# EAGLE design Circuito maquina garra peluches (EAGLE 9.6.2)
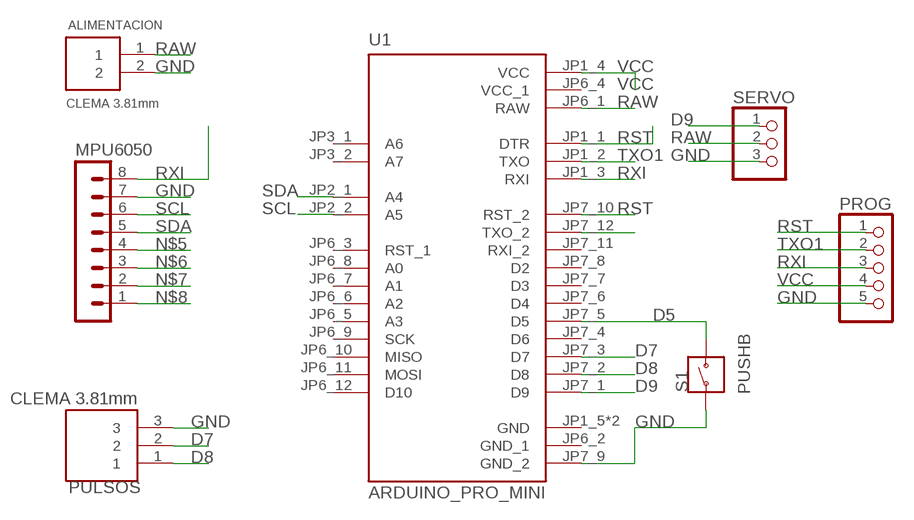
[diagram p0: schematic, sheet 1]

## Parts
ALIMENTACION  CLEMA 3.81mm  1776113-2  [TE_1776113-2]
MPU6050  MA08-1  [MA08-1]
PROG  PINHD-1X5  [1X05]
PULSOS  CLEMA 3.81mm  284392-3  [TE_284392-3]
S1  PUSHB  4-1437565-0  [SW_4-1437565-0]
SERVO  PINHD-1X3/90  [1X03/90]
U1  ARDUINO_PRO_MINI  [MODULE_ARDUINO_PRO_MINI]

## Nets
D5: S1.2 U1.JP7_5(D5)
D7: PULSOS.2 U1.JP7_3(D7)
D8: PULSOS.1 U1.JP7_2(D8)
D9: SERVO.1 U1.JP7_1(D9)
GND: ALIMENTACION.2 MPU6050.7 PROG.5 PULSOS.3 S1.1 SERVO.3 U1.JP7_9(GND_2)
N$5: MPU6050.4
N$6: MPU6050.3
N$7: MPU6050.2
N$8: MPU6050.1
N$11: U1.JP7_12(TXO_2)
RAW: ALIMENTACION.1 SERVO.2 U1.JP6_1(RAW)
RST: PROG.1 U1.JP1_1(DTR) U1.JP7_10(RST_2)
RXI: MPU6050.8 PROG.3 U1.JP1_3(RXI)
SCL: MPU6050.6 U1.JP2_2(A5)
SDA: MPU6050.5 U1.JP2_1(A4)
TXO1: PROG.2 U1.JP1_2(TXO)
VCC: PROG.4 U1.JP1_4(VCC)
Unconnected: U1.JP3_1(A6) U1.JP3_2(A7) U1.JP6_3(RST_1) U1.JP6_5(A3) U1.JP6_6(A2) U1.JP6_7(A1) U1.JP6_8(A0) U1.JP6_9(SCK) U1.JP6_10(MISO) U1.JP6_11(MOSI) U1.JP6_12(D10) U1.JP7_4(D6) U1.JP7_6(D4) U1.JP7_7(D3) U1.JP7_8(D2) U1.JP7_11(RXI_2)

## Power pins joined to a net without a drawn wire
GND: U1.JP1_5(GND) U1.JP1_6(GND)
GND_1: U1.JP6_2(GND_1)
VCC_1: U1.JP6_4(VCC_1)

## Library data of the parts
ALIMENTACION = terminal-block-clema-3.81-1776113-2:1776113-2: Conn Eurostyle Block 2 POS 3.81mm Solder ST Thru-Hole 12A/Contact Check prices <https://pricing.snapeda.com/parts/1776113-2/TE%20Connectivity/view-part?ref=eda>; AVAILABILITY: In Stock; CENTERLINE_PITCH: 3.81 mm[.1499 in]; COMMENT: 1776113-2; DESCRIPTION: 2P,3.81MM,SIDE ENTRY,HIGH TMP; EU_ROHS_COMPLIANCE: Compliant; MF: TE Connectivity; MP: 1776113-2; NUMBER_OF_POSITIONS: 2; PACKAGE: None; PRICE: None; PURCHASE-URL: https://pricing.snapeda.com/search/part/1776113-2/?ref=eda
MPU6050 = con-lstb:MA08-1: PIN HEADER; OC_FARNELL: unknown; OC_NEWARK: unknown
PROG = pinhead:PINHD-1X5: PIN HEADER
PULSOS = terminal-block-clema-3.81-284392-3:284392-3: Check prices <https://pricing.snapeda.com/parts/284392-3/TE%20Connectivity/view-part?ref=eda>; AVAILABILITY: In Stock; COMMENT: 284392-3; DESCRIPTION: Conn Terminal Block 3 POS 3.81mm Solder ST Thru-Hole 12A/Contact; EU_ROHS_COMPLIANCE: Compliant with Exemptions; MF: TE Connectivity; MP: 284392-3; PACKAGE: None; PRICE: None; PURCHASE-URL: https://pricing.snapeda.com/search/part/284392-3/?ref=eda
S1 = pushbutton:4-1437565-0: Switch Tactile OFF (ON) SPST Round Button PC Pins 0.05A 12VDC 1.57N Thru-Hole T/R Check prices <https://pricing.snapeda.com/parts/FSM4JRT/TE%20Connectivity/view-part?ref=eda>; AVAILABILITY: In Stock; COMMENT: 4-1437565-0; DESCRIPTION: features, series, Tactile / Jog, circuitry, voltage, illumination, operation, tactile, style, Pushbutton, Industrial ...; MF: TE Connectivity; MP: FSM4JRT; PACKAGE: None; PRICE: None; PURCHASE-URL: https://pricing.snapeda.com/search/part/FSM4JRT/?ref=eda
SERVO = pinhead:PINHD-1X3: PIN HEADER
U1 = ARDUINO_PRO_MINI:ARDUINO_PRO_MINI: ATmega328 Arduino Pro Mini 328 5V/16MHz AVR® ATmega AVR MCU 8-Bit Embedded Evaluation Board Check prices <https://pricing.snapeda.com/parts/Arduino%20Pro%20Mini/Arduino/view-part?ref=eda>; AVAILABILITY: Not in stock; DESCRIPTION: This board was developed for applications and installations where space is premium and projects are made as permanent set ups. Small, available in 3.3 V and 5 V versions, powered by ATmega328P.; MF: Arduino; MP: Arduino Pro Mini; PACKAGE: None; PRICE: None

## Board
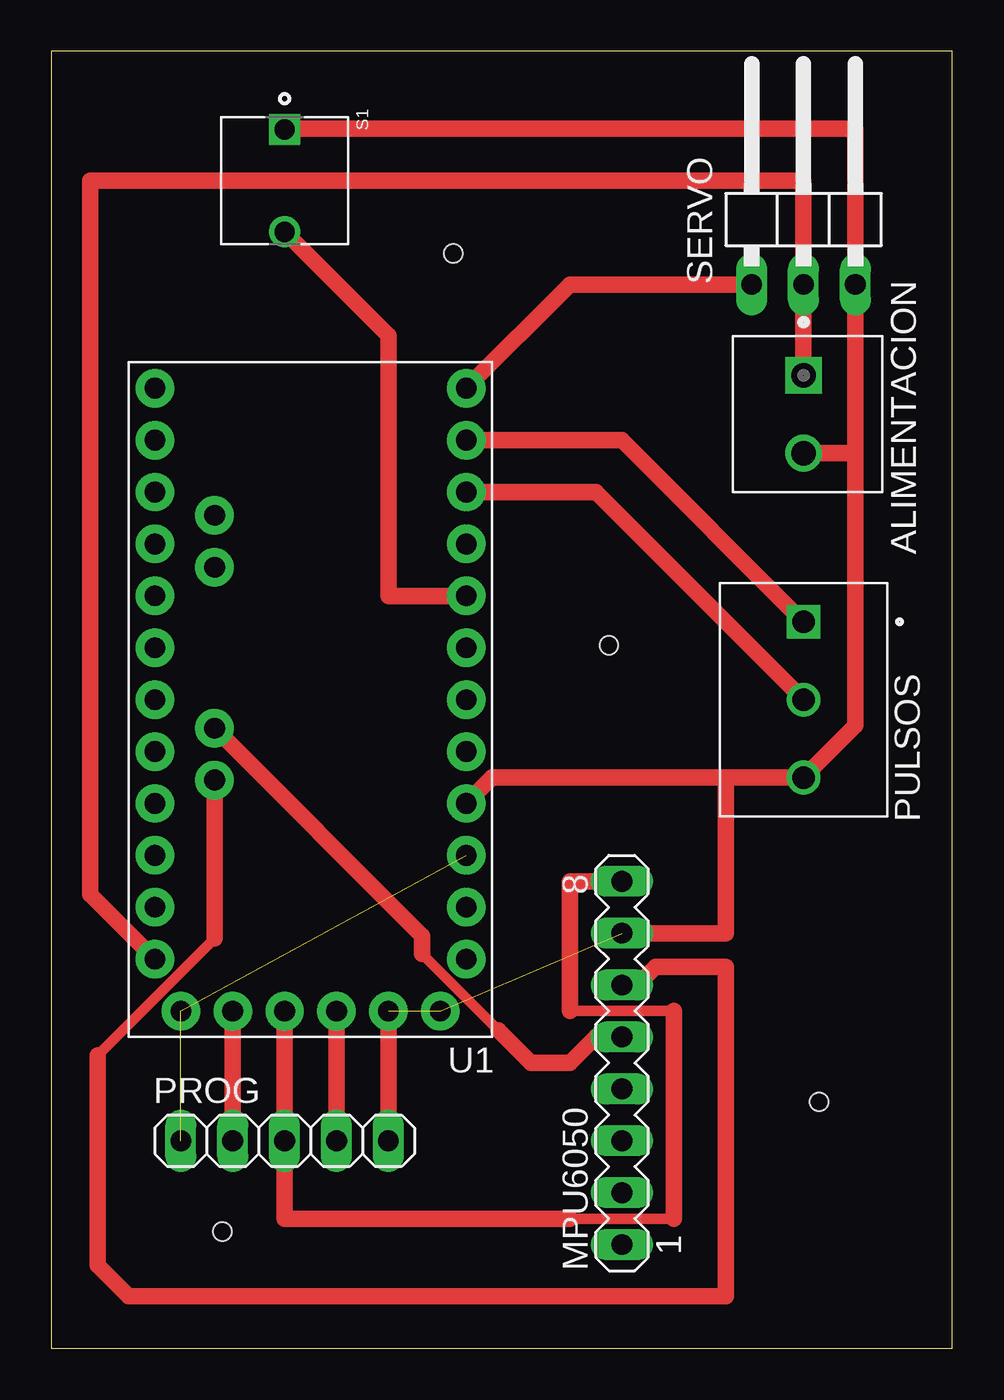
[diagram p1: board, top side]

Size 44.12 x 63.49 mm. Coordinates in mm from the lower left corner, seen from the top.
Outline: 0,0 44.12,0 44.12,63.49 0,63.49 0,0
Copper layers (1*16): Top 0.035mm / dielectric 1.5mm / Bottom 0.035mm
Design rules "default *": minimum track width 6mil, minimum drill 0.35mm, track to track 6mil, track to pad 6mil, pad to pad 6mil, via to via 6mil, smd to smd 6mil, copper to edge 40mil, drill to drill 6mil, minimum pad ring 10mil, minimum via ring 8mil, stop-mask expansion 4mil, vias tented up to drill 0mil, thermal gap 10mil
Holes 0.9 mm at 19.68,53.59 8.38,5.71 27.3,34.42 37.59,12.07

### Footprints (pad centres in the part's own frame; a part is rotated, then mirrored left to right if it is on the bottom)
TE_1776113-2 = drill 1.2 square: 1 -1.905,0 | drill 1.2: 2 1.905,0
MA08-1 = drill 1.016 long: 1 -8.89,0; 2 -6.35,0; 3 -3.81,0; 4 -1.27,0; 5 1.27,0; 6 3.81,0; 7 6.35,0; 8 8.89,0
1X05 = drill 1.016 long: 1 -5.08,0; 2 -2.54,0; 3 0,0; 4 2.54,0; 5 5.08,0
TE_284392-3 = drill 1.1 square: 1 -3.81,0 | drill 1.1: 2 0,0; 3 3.81,0
SW_4-1437565-0 = drill 1 square: 1 -2.502,0 | drill 1: 2 2.502,0
1X03/90 = drill 1.016 long: 1 -2.54,-3.81; 2 0,-3.81; 3 2.54,-3.81
MODULE_ARDUINO_PRO_MINI = drill 1.016 pad 1.88: JP1_1 6.35,15.24; JP1_2 3.81,15.24; JP1_3 1.27,15.24; JP1_4 -1.27,15.24; JP1_5 -3.81,15.24; JP1_6 -6.35,15.24; JP2_1 4.699,1.397; JP2_2 4.699,3.937; JP3_1 4.699,-9.017; JP3_2 4.699,-6.477; JP6_1 7.62,12.7; JP6_2 7.62,10.16; JP6_3 7.62,7.62; JP6_4 7.62,5.08; JP6_5 7.62,2.54; JP6_6 7.62,0; JP6_7 7.62,-2.54; JP6_8 7.62,-5.08; JP6_9 7.62,-7.62; JP6_10 7.62,-10.16; JP6_11 7.62,-12.7; JP6_12 7.62,-15.24; JP7_1 -7.62,-15.24; JP7_2 -7.62,-12.7; JP7_3 -7.62,-10.16; JP7_4 -7.62,-7.62; JP7_5 -7.62,-5.08; JP7_6 -7.62,-2.54; JP7_7 -7.62,0; JP7_8 -7.62,2.54; JP7_9 -7.62,5.08; JP7_10 -7.62,7.62; JP7_11 -7.62,10.16; JP7_12 -7.62,12.7

### Placement (x,y rotation side)
ALIMENTACION  36.83,45.72 270 top
MPU6050  27.94,13.97 90 top
PROG  11.43,10.16 0 top
PULSOS  36.83,31.75 270 top
S1  11.43,57.15 270 top
SERVO  36.83,55.88 0 top
U1  12.7,31.75 180 top

### Tracks (layer width: path | path; a pad name or v marks a point on that pad's centre or on a via)
D5
  Top 0.813: S1.2 16.51,49.57 16.51,36.83 U1.JP7_5
D7
  Top 0.813: U1.JP7_3 26.67,41.91 PULSOS.2
D8
  Top 0.813: U1.JP7_2 27.94,44.45 PULSOS.1
D9
  Top 0.813: U1.JP7_1 25.4,52.07 SERVO.1
GND  (2 unrouted)
  Top 0.813: U1.JP1_5 PROG.5 | 29.21,20.32 MPU6050.7 33.02,20.32 33.02,27.94 | 39.37,43.69 39.37,30.48 PULSOS.3 33.02,27.94 | 39.37,43.69 SERVO.3 39.37,59.69 11.47,59.69 S1.1 | U1.JP7_9 21.59,27.94 33.02,27.94 | ALIMENTACION.2 39.24,43.81 39.37,43.69
RAW
  Top 0.813: ALIMENTACION.1 SERVO.2 36.83,57.15 1.91,57.15 1.91,22.23 U1.JP6_1
RST  (2 unrouted)
RXI
  Top 0.508: 25.4,16.51 30.48,16.51 | 30.48,6.35 25.4,6.35
  Top 0.813: U1.JP1_3 PROG.3 11.43,6.35 25.4,6.35 | MPU6050.8 25.4,22.86 25.4,16.51 | 30.48,16.51 30.48,6.35
SCL
  Top 0.508: 8,20.07 2.29,14.35
  Top 0.813: U1.JP2_2 8,20.07 | 2.29,14.35 2.29,4.06 3.81,2.54 33.02,2.54 33.02,18.67 29.59,18.67 28.57,17.65 28.07,17.65 MPU6050.6
SDA
  Top 0.508: 22.22,15.24 21.91,15.56 18.16,19.3
  Top 0.813: U1.JP2_1 18.16,20.19 18.16,19.3 | 21.91,15.56 23.49,13.97 25.4,13.97 26.67,15.24 MPU6050.5
TXO1
  Top 0.813: PROG.2 U1.JP1_2
VCC
  Top 0.813: PROG.4 U1.JP1_4